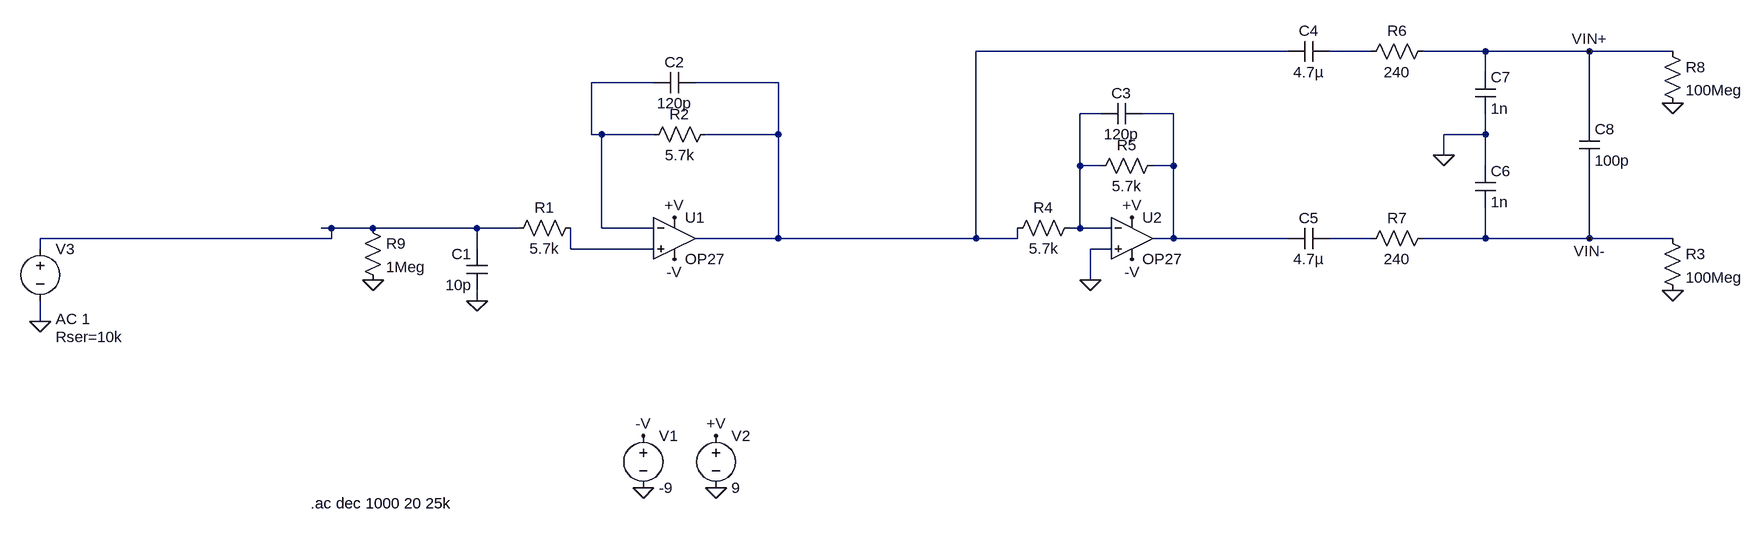
[diagram p0: schematic AD1974_input_stage_sim.asc]
AD1974_input_stage_sim.asc, the LTspice schematic file:
Version 4
SHEET 1 1860 680
WIRE 1152 -128 672 -128
WIRE 1280 -128 1216 -128
WIRE 1456 -128 1360 -128
WIRE 1616 -128 1456 -128
WIRE 1744 -128 1616 -128
WIRE 1456 -96 1456 -128
WIRE 176 -80 80 -80
WIRE 368 -80 240 -80
WIRE 864 -32 832 -32
WIRE 976 -32 928 -32
WIRE 1616 -16 1616 -128
WIRE 80 0 80 -80
WIRE 96 0 80 0
WIRE 176 0 96 0
WIRE 368 0 368 -80
WIRE 368 0 256 0
WIRE 1456 0 1456 -32
WIRE 1456 0 1392 0
WIRE 1392 32 1392 0
WIRE 832 48 832 -32
WIRE 864 48 832 48
WIRE 976 48 976 -32
WIRE 976 48 944 48
WIRE 1456 48 1456 0
WIRE -320 144 -336 144
WIRE -256 144 -320 144
WIRE -96 144 -256 144
WIRE -32 144 -96 144
WIRE 96 144 96 0
WIRE 176 144 96 144
WIRE 832 144 832 48
WIRE 832 144 816 144
WIRE 880 144 832 144
WIRE -320 160 -320 144
WIRE -320 160 -768 160
WIRE 368 160 368 0
WIRE 368 160 240 160
WIRE 672 160 672 -128
WIRE 672 160 368 160
WIRE 736 160 736 144
WIRE 736 160 672 160
WIRE 976 160 976 48
WIRE 976 160 944 160
WIRE 1152 160 976 160
WIRE 1280 160 1216 160
WIRE 1456 160 1456 112
WIRE 1456 160 1360 160
WIRE 1616 160 1616 48
WIRE 1616 160 1456 160
WIRE 1744 160 1616 160
WIRE -768 176 -768 160
WIRE -96 176 -96 144
WIRE 48 176 48 144
WIRE 176 176 48 176
WIRE 880 176 848 176
WIRE 848 224 848 176
WIRE -96 256 -96 240
WIRE -768 288 -768 256
FLAG 160 544 0
FLAG 272 544 0
FLAG -96 256 0
FLAG -768 288 0
FLAG 160 464 -V
FLAG 272 464 +V
FLAG 208 192 -V
FLAG 208 128 +V
FLAG 912 128 +V
FLAG 912 192 -V
FLAG 848 224 0
FLAG 1392 32 0
FLAG 1616 -128 VIN+
FLAG 1616 160 VIN-
FLAG -256 224 0
FLAG 1744 -48 0
FLAG 1744 240 0
SYMBOL voltage 160 448 R0
WINDOW 123 0 0 Left 0
WINDOW 39 0 0 Left 0
SYMATTR InstName V1
SYMATTR Value -9
SYMBOL voltage 272 448 R0
WINDOW 123 0 0 Left 0
WINDOW 39 0 0 Left 0
SYMATTR InstName V2
SYMATTR Value 9
SYMBOL res 64 128 R90
WINDOW 0 0 56 VBottom 2
WINDOW 3 32 56 VTop 2
SYMATTR InstName R1
SYMATTR Value 5.7k
SYMBOL res 272 -16 R90
WINDOW 0 0 56 VBottom 2
WINDOW 3 32 56 VTop 2
SYMATTR InstName R2
SYMATTR Value 5.7k
SYMBOL cap 240 -96 R90
WINDOW 0 0 32 VBottom 2
WINDOW 3 32 32 VTop 2
SYMATTR InstName C2
SYMATTR Value 120p
SYMBOL voltage -768 160 R0
WINDOW 123 24 124 Left 2
WINDOW 39 24 152 Left 2
SYMATTR Value2 AC 1
SYMATTR SpiceLine Rser=10k
SYMATTR InstName V3
SYMATTR Value ""
SYMBOL res 832 128 R90
WINDOW 0 0 56 VBottom 2
WINDOW 3 32 56 VTop 2
SYMATTR InstName R4
SYMATTR Value 5.7k
SYMBOL res 960 32 R90
WINDOW 0 0 56 VBottom 2
WINDOW 3 32 56 VTop 2
SYMATTR InstName R5
SYMATTR Value 5.7k
SYMBOL cap 928 -48 R90
WINDOW 0 0 32 VBottom 2
WINDOW 3 32 32 VTop 2
SYMATTR InstName C3
SYMATTR Value 120p
SYMBOL cap 1216 -144 R90
WINDOW 0 0 32 VBottom 2
WINDOW 3 32 32 VTop 2
SYMATTR InstName C4
SYMATTR Value 4.7µ
SYMBOL res 1376 -144 R90
WINDOW 0 0 56 VBottom 2
WINDOW 3 32 56 VTop 2
SYMATTR InstName R6
SYMATTR Value 240
SYMBOL cap 1216 144 R90
WINDOW 0 0 32 VBottom 2
WINDOW 3 32 32 VTop 2
SYMATTR InstName C5
SYMATTR Value 4.7µ
SYMBOL res 1376 144 R90
WINDOW 0 0 56 VBottom 2
WINDOW 3 32 56 VTop 2
SYMATTR InstName R7
SYMATTR Value 240
SYMBOL cap 1600 -16 R0
SYMATTR InstName C8
SYMATTR Value 100p
SYMBOL OpAmps\\OP27 208 96 R0
SYMATTR InstName U1
SYMBOL OpAmps\\OP27 912 96 R0
SYMATTR InstName U2
SYMBOL cap -80 240 R180
WINDOW 0 24 56 Left 2
WINDOW 3 24 8 Left 2
SYMATTR InstName C1
SYMATTR Value 10p
SYMBOL res 1728 144 R0
SYMATTR InstName R3
SYMATTR Value 100Meg
SYMBOL res 1728 -144 R0
SYMATTR InstName R8
SYMATTR Value 100Meg
SYMBOL res -272 128 R0
SYMATTR InstName R9
SYMATTR Value 1Meg
SYMBOL cap 1440 48 R0
SYMATTR InstName C6
SYMATTR Value 1n
SYMBOL cap 1440 -96 R0
SYMATTR InstName C7
SYMATTR Value 1n
TEXT -352 568 Left 2 !.ac dec 1000 20 25k

The netlist it stands for:
* AD1974_input_stage_sim.asc
V1 -V 0 -9
V2 +V 0 9
R1 N008 N006 5.7k
R2 N001 N003 5.7k
C2 N001 N003 120p
V3 N006 0 AC 1 Rser=10k
R4 N004 N001 5.7k
R5 N005 N004 5.7k
C3 N005 N004 120p
C4 N002 N001 4.7µ
R6 VIN+ N002 240
C5 N007 N005 4.7µ
R7 VIN- N007 240
C8 VIN+ VIN- 100p
XU1 N008 N003 +V -V N001 OP27  ; pins In+ In- V+ V- OUT
XU2 0 N004 +V -V N005 OP27  ; pins In+ In- V+ V- OUT
C1 0 N006 10p
R3 VIN- 0 100Meg
R8 VIN+ 0 100Meg
R9 N006 0 1Meg
C6 0 VIN- 1n
C7 VIN+ 0 1n
.ac dec 1000 20 25k
.lib ADI.lib
.backanno
.end